# Altium schematic sheet Peripheral.SchDoc
size A3
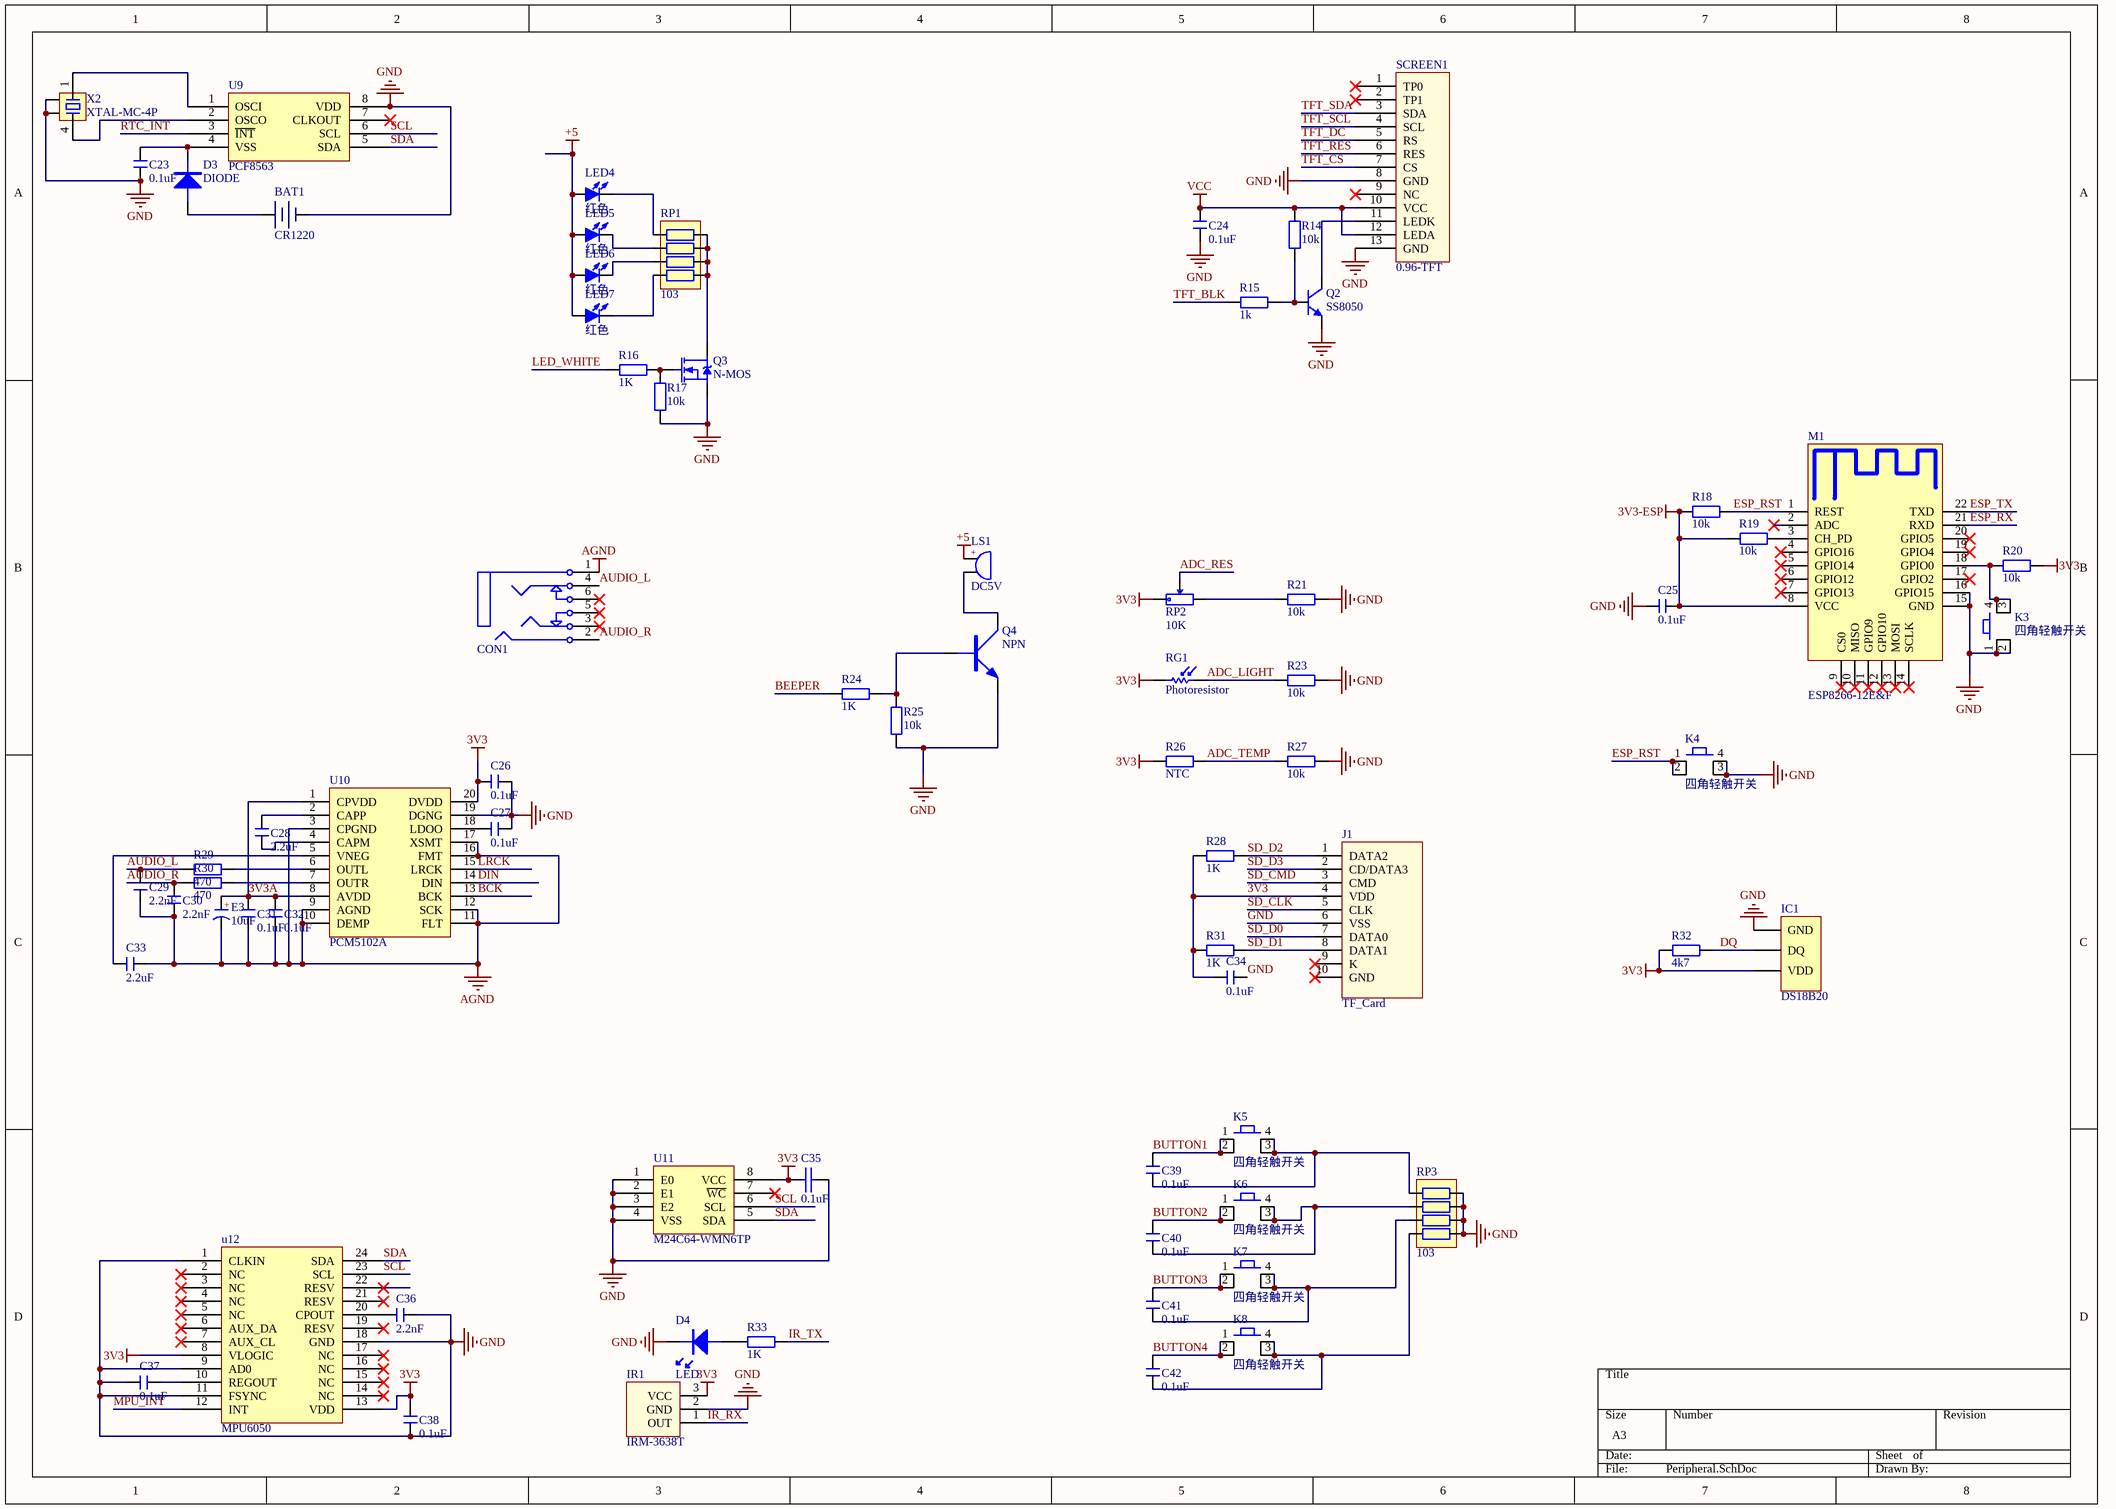
[diagram p0: Peripheral.SchDoc]

## Parts
BAT1  CR1220  [CR1220-A]
C23  0.1uF  [C 0603_L]
C24  0.1uF  [C 1206_L]
C25  0.1uF  [C 1206_L]
C26  0.1uF  [C 0603_L]
C27  0.1uF  [C 0603_L]
C28  2.2uF  [C 0603_L]
C29  2.2nF  [C 0603_L]
C30  2.2nF  [C 0603_L]
C31  0.1uF  [C 1206_L]
C32  0.1uF  [C 1206_L]
C33  2.2uF  [C 0603_L]
C34  0.1uF  [C 0603_L]
C35  0.1uF  [C 1206_L]
C36  2.2nF  [C 0603_L]
C37  0.1uF  [C 1206_L]
C38  0.1uF  [C 0603_L]
C39  0.1uF  [C 1206_L]
C40  0.1uF  [C 1206_L]
C41  0.1uF  [C 1206_L]
C42  0.1uF  [C 1206_L]
CON1  PJ342  [PJ342A]  (value not drawn)
D3  DIODE  [SOD-123]
D4  LED  [LED3-RED]
E3  10uF  [CM C(5*5.4)]
IC1  DS18B20  [TO92A]
IR1  IRM-3638T  [IRM-3638T]
J1  TF_Card  [Micro SD]
K3  四角轻触开关  [四角贴片开关]
K4  四角轻触开关  [四角贴片开关]
K5  四角轻触开关  [四角贴片开关]
K6  四角轻触开关  [四角贴片开关]
K7  四角轻触开关  [四角贴片开关]
K8  四角轻触开关  [四角贴片开关]
LED4  红色  [LED 1206W]
LED5  红色  [LED 1206W]
LED6  红色  [LED 1206W]
LED7  红色  [LED 1206W]
LS1  DC5V  [BUZZER-7525]
M1  ESP8266-12E&F  [ESP_12]
Q2  SS8050  [SOT-23]
Q3  N-MOS  [SOT23]
Q4  NPN  [SOT-23]
R14  10k  [R 0603_L]
R15  1k  [R 0603_L]
R16  1K  [R 0603_L]
R17  10k  [R 0603_L]
R18  10k  [R 0603_L]
R19  10k  [R 0603_L]
R20  10k  [R 0603_L]
R21  10k  [R 0603_L]
R23  10k  [R 0603_L]
R24  1K  [R 0603_L]
R25  10k  [R 0603_L]
R26  NTC  [R 0603_L]
R27  10k  [R 0603_L]
R28  1K  [R 0603_L]
R29  470  [R 0603_L]
R30  470  [R 0603_L]
R31  1K  [R 0603_L]
R32  4k7  [R 0603_L]
R33  1K  [R 0603_L]
RG1  Photoresistor  [Photoresistor]
RP1  103  [RCA-8P4R-0603]
RP2  10K  [拨盘电位器]
RP3  103  [RCA-8P4R-0603]
SCREEN1  0.96-TFT  [0.96-TFT]
U9  PCF8563  [SOP127P600X175-8N]
U10  PCM5102A  [TSSOP20]
U11  M24C64-WMN6TP  [SOP8]
u12  MPU6050  [QFN24 4x4]
X2  XTAL-MC-4P  [OSC MC-306]

## Nets
3V3: C26.2 C34.2 C35.2 C38.2 IC1.3(VDD) IR1.3(VCC) J1.4(VDD) R20.2 R26.1 R28.1 R31.1 R32.1 RG1.1 RP2.1 U10.20(DVDD) U11.8(VCC) u12.8(VLOGIC) u12.13(VDD)
3V3-ESP: C25.1 M1.8(VCC) R18.1 R19.1
+5: LED4.1(A) LED5.1(A) LED6.1(A) LED7.1(A) LS1.1
AGND: C29.1 C30.1 C31.1 C32.1 C33.1 CON1.1 E3.2(K) U10.3(CPGND) U10.9(AGND) U10.10(DEMP) U10.11(FLT) U10.12(SCK) U10.16(FMT) U10.17(XSMT)
GND: BAT1.2 C23.2 C24.2 C25.2 C26.1 C27.1 C34.1 C35.1 C36.2 C37.1 C38.1 D4.K IC1.1(GND) IR1.2(GND) J1.6(VSS) K3.1 K3.2 K4.3 K4.4 M1.15(GND) M1.16(GPIO15) Q2.2(E) Q3.S Q4.E R17.1 R21.1 R23.1 R25.1 R27.1 RP3.5 RP3.6 RP3.7 RP3.8 SCREEN1.8(GND) SCREEN1.13(GND) U9.8(VDD) U10.19(DGNG) U11.1(E0) U11.2(E1) U11.3(E2) U11.4(VSS) u12.1(CLKIN) u12.9(AD0) u12.11(FSYNC) u12.18(GND) X2.2 X2.3
VCC: C24.1 R14.2 SCREEN1.10(VCC) SCREEN1.12(LEDA)
3V3A: C31.2 C32.2 E3.1(A) U10.1(CPVDD) U10.8(AVDD)
ADC_LIGHT: R23.2 RG1.2
ADC_RES: RP2.2
ADC_TEMP: R26.2 R27.2
AUDIO_L: C29.2 CON1.4 R29.1
AUDIO_R: C30.2 CON1.2 R30.1
BCK: U10.13(BCK)
BEEPER: R24.1
BUTTON1: C39.1 K5.1 K5.2
BUTTON2: C40.1 K6.1 K6.2
BUTTON3: C41.1 K7.1 K7.2
BUTTON4: C42.1 K8.1 K8.2
DIN: U10.14(DIN)
DQ: IC1.2(DQ) R32.2
ESP_RST: K4.1 K4.2 M1.1(REST) R18.2
ESP_RX: M1.21(RXD)
ESP_TX: M1.22(TXD)
IR_RX: IR1.1(OUT)
IR_TX: R33.2
LED_WHITE: R16.1
LRCK: U10.15(LRCK)
MPU_INT: u12.12(INT)
RTC_INT: U9.3(~{INT})
SCL: U9.6(SCL) U11.6(SCL) u12.23(SCL)
SD_CLK: J1.5(CLK)
SD_CMD: J1.3(CMD)
SD_D0: J1.7(DATA0)
SD_D1: J1.8(DATA1) R31.2
SD_D2: J1.1(DATA2) R28.2
SD_D3: J1.2(CD/DATA3)
SDA: U9.5(SDA) U11.5(SDA) u12.24(SDA)
TFT_BLK: R15.2
TFT_CS: SCREEN1.7(CS)
TFT_DC: SCREEN1.5(RS)
TFT_RES: SCREEN1.6(RES)
TFT_SCL: SCREEN1.4(SCL)
TFT_SDA: SCREEN1.3(SDA)
NetBAT1_1: BAT1.1 D3.A
NetC23_1: C23.1 D3.K U9.4(VSS)
NetC27_2: C27.2 U10.18(LDOO)
NetC28_1: C28.1 U10.2(CAPP)
NetC28_2: C28.2 U10.4(CAPM)
NetC33_2: C33.2 U10.5(VNEG)
NetC36_1: C36.1 u12.20(CPOUT)
NetC37_2: C37.2 u12.10(REGOUT)
NetC39_2: C39.2 K5.3 K5.4 RP3.1
NetC40_2: C40.2 K6.3 K6.4 RP3.2
NetC41_2: C41.2 K7.3 K7.4 RP3.3
NetC42_2: C42.2 K8.3 K8.4 RP3.4
NetD4_A: D4.A R33.1
NetK3_3: K3.3 K3.4 M1.18(GPIO0) R20.1
NetLED4_2: LED4.2(K) RP1.1
NetLED5_2: LED5.2(K) RP1.2
NetLED6_2: LED6.2(K) RP1.3
NetLED7_2: LED7.2(K) RP1.4
NetLS1_2: LS1.2 Q4.C
NetM1_3: M1.3(CH_PD) R19.2
NetQ2_1: Q2.1(B) R14.1 R15.1
NetQ2_3: Q2.3(C) SCREEN1.11(LEDK)
NetQ3_D: Q3.D RP1.5 RP1.6 RP1.7 RP1.8
NetQ3_G: Q3.G R16.2 R17.2
NetQ4_B: Q4.B R24.2 R25.2
NetR21_2: R21.2 RP2.3
NetR29_2: R29.2 U10.6(OUTL)
NetR30_2: R30.2 U10.7(OUTR)
NetU9_1: U9.1(OSCI) X2.1
NetU9_2: U9.2(OSCO) X2.4

Not connected (* = marked no-connect by the designer): CON1 3* 5* 6*; J1 9(K)* 10(GND)*; M1 2(ADC)* 4(GPIO16)* 5(GPIO14)* 6(GPIO12)* 7(GPIO13)* 9(CS0)* 10(MISO)* 11(GPIO9)* 12(GPIO10)* 13(MOSI)* 14(SCLK)* 17(GPIO2)* 19(GPIO4)* 20(GPIO5)*; SCREEN1 1(TP0)* 2(TP1)* 9(NC)*; U9 7(CLKOUT)*; U11 7(~{WC})*; u12 2(NC)* 3(NC)* 4(NC)* 5(NC)* 6(AUX_DA)* 7(AUX_CL)* 14(NC)* 15(NC)* 16(NC)* 17(NC)* 19(RESV)* 21(RESV)* 22(RESV)*

## Notes on the sheet
- (in symbol BEEP) +
- (in symbol C-CM) +

## Library data of the parts
C23-C33 C39-C42 = C: 村田1206电容; BOM名称: 无极性贴片电容; 版权归属: 源创客; 材质: X7R; 学习资源: www.ooocke.com
C34 C36-C38 = C: 无极性贴片电容; 版权归属: 源创客; 材质: X7R; BOM名称: 无极性贴片电容; 学习资源: www.ooocke.com
C35 = CAP: 无极性电容
CON1 = PJ342: 3.5耳机插座,4Pin; BOM名称: 耳机插座; 版权归属: 源创客; 学习资源: www.ooocke.com
D3 = DIODE: 普通二极管
E3 = C-CM: 贴片电解电容; 版权归属: 源创客; BOM名称: 贴片电解电容; 学习资源: www.ooocke.com
IC1 = DS18B20: 数字温度计; 版权归属: 源创客; BOM名称: 数字温度计; 学习资源: www.ooocke.com
J1 = TF_Card: TF卡座; 版权归属: 源创客; BOM名称: TF卡座; 学习资源: www.ooocke.com
LED4-LED7 = LED-SMD: 贴片LED; 版权归属: 源创客; BOM名称: 贴片LED; 学习资源: www.ooocke.com
LS1 = BEEP: 蜂鸣器; 版权归属: 源创客; BOM名称: 蜂鸣器; 学习资源: www.ooocke.com
M1 = ESP8266-12: 串口 WIFI模块，ESP-12E&F; BOM名称: WIFI模块; 版权归属: 源创客; 学习资源: www.ooocke.com
Q2 = 8050-SMD: 高频放大-NPN型; 版权归属: 源创客; 属性: 40V 1.5A 1W 100MHZ; BOM名称: 高频放大-NPN型; 学习资源: www.ooocke.com
Q3 = N-MOS: N沟道场效应管
Q4 = NPN: NPN三极管
R14-R21 R23-R33 = R: 贴片电阻; 版权归属: 源创客; BOM名称: 贴片电阻; 学习资源: www.ooocke.com
RG1 = Photoresistor: 光敏电阻
RP1 RP3 = R-8P4R: 贴片网络排阻; 版权归属: 源创客; BOM名称: 贴片网络排阻; 学习资源: www.ooocke.com
RP2 = RP-SMD: 贴片电位器; 版权归属: 源创客; BOM名称: 贴片电位器; 学习资源: www.ooocke.com
X2 = XTAL-MC-4P: MC系列4脚晶振